# Altium schematic sheet MODULE_STRAPS_SAIL.SchDoc: MODULE STRAPS SAIL
size A3; Author: Silvio Navaretti; CompanyName: ARDUINO; DrawnBy: Silvio Navaretti; Engineer: Silvio Navaretti; Organization: ARDUINO; SheetNumber: 8; SheetTotal: 51; RevAuthor: Silvio Navaretti
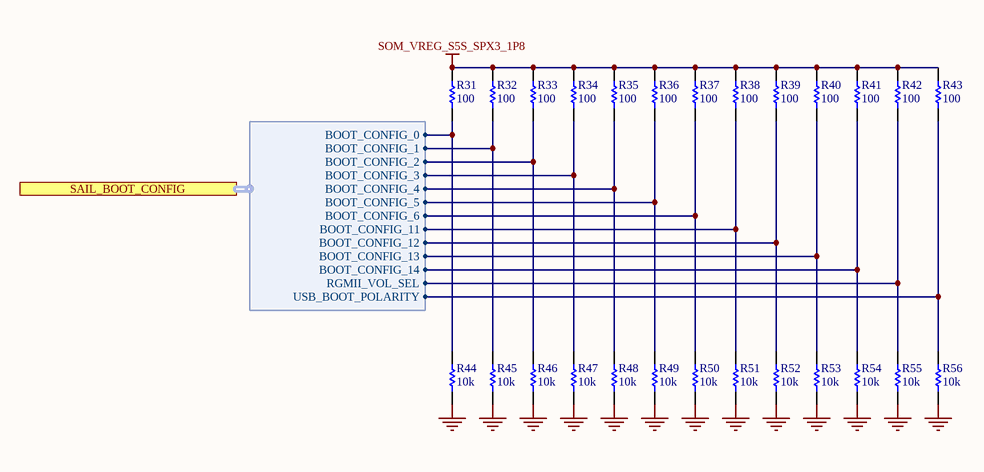
[diagram p0: MODULE_STRAPS_SAIL.SchDoc]

## Parts
R31  value 100  [RES-0201]  (hidden comment: RC0201FR-07100RL)
R32  value 100  [RES-0201]  (hidden comment: RC0201FR-07100RL)
R33  value 100  [RES-0201]  (hidden comment: RC0201FR-07100RL)
R34  value 100  [RES-0201]  (hidden comment: RC0201FR-07100RL)
R35  value 100  [RES-0201]  (hidden comment: RC0201FR-07100RL)
R36  value 100  [RES-0201]  (hidden comment: RC0201FR-07100RL)
R37  value 100  [RES-0201]  (hidden comment: RC0201FR-07100RL)
R38  value 100  [RES-0201]  (hidden comment: RC0201FR-07100RL)
R39  value 100  [RES-0201]  (hidden comment: RC0201FR-07100RL)
R40  value 100  [RES-0201]  (hidden comment: RC0201FR-07100RL)
R41  value 100  [RES-0201]  (hidden comment: RC0201FR-07100RL)
R42  value 100  [RES-0201]  (hidden comment: RC0201FR-07100RL)
R43  value 100  [RES-0201]  (hidden comment: RC0201FR-07100RL)
R44  value 10k  [RES-0201]  (hidden comment: RC0201FR-0710KL)
R45  value 10k  [RES-0201]  (hidden comment: RC0201FR-0710KL)
R46  value 10k  [RES-0201]  (hidden comment: RC0201FR-0710KL)
R47  value 10k  [RES-0201]  (hidden comment: RC0201FR-0710KL)
R48  value 10k  [RES-0201]  (hidden comment: RC0201FR-0710KL)
R49  value 10k  [RES-0201]  (hidden comment: RC0201FR-0710KL)
R50  value 10k  [RES-0201]  (hidden comment: RC0201FR-0710KL)
R51  value 10k  [RES-0201]  (hidden comment: RC0201FR-0710KL)
R52  value 10k  [RES-0201]  (hidden comment: RC0201FR-0710KL)
R53  value 10k  [RES-0201]  (hidden comment: RC0201FR-0710KL)
R54  value 10k  [RES-0201]  (hidden comment: RC0201FR-0710KL)
R55  value 10k  [RES-0201]  (hidden comment: RC0201FR-0710KL)
R56  value 10k  [RES-0201]  (hidden comment: RC0201FR-0710KL)

## Ports
SAIL_BOOT_CONFIG (harness SOM_SAIL_BOOT_CONFIG)

## Harnesses
SOM_SAIL_BOOT_CONFIG: BOOT_CONFIG_0, BOOT_CONFIG_1, BOOT_CONFIG_2, BOOT_CONFIG_3, BOOT_CONFIG_4, BOOT_CONFIG_5, BOOT_CONFIG_6, BOOT_CONFIG_11, BOOT_CONFIG_12, BOOT_CONFIG_13, BOOT_CONFIG_14, RGMII_VOL_SEL, USB_BOOT_POLARITY

## Nets
GND: R44.1 R45.1 R46.1 R47.1 R48.1 R49.1 R50.1 R51.1 R52.1 R53.1 R54.1 R55.1 R56.1
SOM_VREG_S5S_SPX3_1P8: R31.1 R32.1 R33.1 R34.1 R35.1 R36.1 R37.1 R38.1 R39.1 R40.1 R41.1 R42.1 R43.1
NetR31_2: R31.2 R44.2 ; port SAIL_BOOT_CONFIG.BOOT_CONFIG_0
NetR32_2: R32.2 R45.2 ; port SAIL_BOOT_CONFIG.BOOT_CONFIG_1
NetR33_2: R33.2 R46.2 ; port SAIL_BOOT_CONFIG.BOOT_CONFIG_2
NetR34_2: R34.2 R47.2 ; port SAIL_BOOT_CONFIG.BOOT_CONFIG_3
NetR35_2: R35.2 R48.2 ; port SAIL_BOOT_CONFIG.BOOT_CONFIG_4
NetR36_2: R36.2 R49.2 ; port SAIL_BOOT_CONFIG.BOOT_CONFIG_5
NetR37_2: R37.2 R50.2 ; port SAIL_BOOT_CONFIG.BOOT_CONFIG_6
NetR38_2: R38.2 R51.2 ; port SAIL_BOOT_CONFIG.BOOT_CONFIG_11
NetR39_2: R39.2 R52.2 ; port SAIL_BOOT_CONFIG.BOOT_CONFIG_12
NetR40_2: R40.2 R53.2 ; port SAIL_BOOT_CONFIG.BOOT_CONFIG_13
NetR41_2: R41.2 R54.2 ; port SAIL_BOOT_CONFIG.BOOT_CONFIG_14
NetR42_2: R42.2 R55.2 ; port SAIL_BOOT_CONFIG.RGMII_VOL_SEL
NetR43_2: R43.2 R56.2 ; port SAIL_BOOT_CONFIG.USB_BOOT_POLARITY

## Notes on the sheet
- Title:
- ID:
- Date:
- Time:
- Version:
- Sheet
- of
- RevAuthor:
- Reference Designs ARE PROVIDED "AS IS" AND "WITH ALL FAULTS. Arduino SA DISCLAIMS ALL OTHER WARRANTIES, EXPRESS OR IMPLIED, REGARDING PRODUCTS, INCLUDING BUT NOT LIMITED TO, ANY IMPLIED WARRANTIES OF MERCHANTABILITY OR FITNESS FOR A PARTICULAR PURPOSE.
  Arduino SA may make changes to specifications and product descriptions at any time, without notice. The Customer must not rely on the absence or characteristics of any features or instructions marked "reserved" or "undefined".
  Arduino SA reserves these for future definition and shall have no responsibility whatsoever for conflicts or incompatibilities arising from future changes to them. The product information on the Web Site or Materials is subject to change without notice.
  Do not finalize a design with this info. ARDUINO and other Arduino brands and logos and Trademarks of Arduino SA. All Arduino SA Trademarks cannot be used without owner's formal permission.
- File:
- Author:

## Library data of the parts
R31-R43 = R0235-A.13: RES CHIP 0201 100R 1% 1/20W; Manufacturer: YAGEO; Power: 50mW; Temperature coefficient: 200ppm; Code Arduino: R0235; Tolerance: 1%; Case Code (Imperial): 0201; Technology: Thick film; Part Number: RC0201FR-07100RL
R44-R56 = R0145-A.21: RES CHIP 0201 10k 1% 1/20W; Manufacturer: Yageo; Power: 50mW; Temperature coefficient: 200ppm; Code Arduino: R0145; Manufacturer 2: Samsung Electro-Mechanics; Tolerance: 1%; Case Code (Imperial): 0201; Part Number: RC0201FR-0710KL; Technology: Thick film